# Altium schematic sheet CM5_Schem_V2.SchDoc (part 3 of 3)
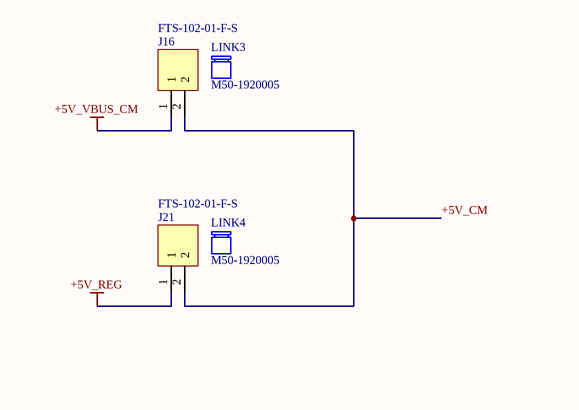
[diagram p5: CM5_Schem_V2.SchDoc, bottom right]

## Library data of the parts (continued)
U6 = TPS563209DDCR: IC REG BUCK ADJ 3A SOT23; Manufacturer: Texas Instruments; Package Body Material: Plastic; Throw Configuration: SWITCHING REGULATOR; Control Technique: PULSE WIDTH MODULATION; Max Supply Voltage: 17V; Min Input Voltage: 4.5V; Nominal Supply Voltage: 12V; Channels: 1; Max Output current: 5.3A; Frequency: 650kHz; Supplier: Digikey; Supplier Part Number: 296-40813-1-ND; Manufacturer Part Number: TPS563209DDCR; RoHS: Yes; Category: Voltage Regulators - Switching; Stock: 3662; Pricing: 1=0.9, 10=0.643, 25=0.5796, 100=0.5095, 250=0.47608, 500=0.45596, 1000=0.43938 (USD); Case/Package: TSSOP; Pins: 6; Package Shape: Rectangular; Terminal Finish: Tin; Min Operating Temperature: -40°C; Max Operating Temperature: 85°C; JESD-609 Code: e3; JESD-30 Code: R-PDSO-G6; Moisture Sensitivity Level: 1; Package Style: SMALL OUTLINE, THIN PROFILE, SHRINK PITCHMeter; Peak Reflow Temperature (Cel): 260°C; Surface Mount: Yes; Switcher Configuration: BUCK; Terminal Form: Gull Wing; Terminal Position: DUAL; Length: 2.9mm; Width: 1.6mm; Height - Seated (Max): 1.1mm; Terminal Pitch: 0.95mm; Temperature Grade: INDUSTRIAL; Reach SVHC Compliant: Yes; RoHS Compliant: Yes; ComponentLink1URL: https://www.ti.com:443/lit/ds/symlink/tps562209.pdf?src-supplier=IHS+Markit; ComponentLink1Description: https://www.ti.com:443/lit/ds/symlink/tps562209.pdf?src-supplier=IHS+Markit; ComponentLink2URL: http://www.ti.com/general/docs/lit/getliterature.tsp?genericPartNumber=TPS562209&&fileType=pdf&src-supplier=Avnet; ComponentLink2Description: http://www.ti.com/general/docs/lit/getliterature.tsp?genericPartNumber=TPS562209&&fileType=pdf&src-supplier=Avnet; ComponentLink3URL: http://www.ti.com/general/docs/suppproductinfo.tsp?distId=10&amp;gotoUrl=http%3A%2F%2Fwww.ti.com%2Flit%2Fgpn%2Ftps563209&src-supplier=Digikey; ComponentLink3Description: http://www.ti.com/general/docs/suppproductinfo.tsp?distId=10&amp;gotoUrl=http%3A%2F%2Fwww.ti.com%2Flit%2Fgpn%2Ftps563209&src-supplier=Digikey; ComponentLink4URL: http://www.ti.com/lit/ds/symlink/tps563209.pdf?src-supplier=Digikey; ComponentLink4Description: http://www.ti.com/lit/ds/symlink/tps563209.pdf?src-supplier=Digikey; ComponentLink5URL: http://www.ti.com/lit/gpn/tps563209?src-supplier=Mouser; ComponentLink5Description: http://www.ti.com/lit/gpn/tps563209?src-supplier=Mouser; LCSC Part Number: C181974
U22 = DF40C-100DS-0.4V(51)_MOD1A: CONN RCPT 100POS SMD GOLD; Manufacturer: Hirose; Connector Type: BOARD CONNECTOR; Option: General Purpose; Additional Feature: ROHS COMPLIANT; Body/Shell Style: RECEPTACLE; Contact Pattern: RECTANGULAR; Contact Resistance: 90mR; Dielectric Withstanding Voltage (AC): 100V; Durability: 30Cycles; Filter Feature: No; Insulation Resistance: 50MR; Number Of Connectors: 1; Number Of PCB Rows: 2; Polarization Key: POLARIZED HOUSING; Rated Current (Signal): 300mA; Number of Contacts: 100; Mating Contact Pitch: 0.016inch; Mounting Option 1: LOCKING; PCB Contact Row Spacing: 2.6416mm; Reference Standard: UL; Reliability: COMMERCIAL; Supplier: Digikey; Supplier Part Number: H11615CT-ND; Manufacturer Part Number: DF40C-100DS-0.4V(51); RoHS: Yes; Category: Card Edge Connectors; Stock: 81087; Pricing: 1=1.76, 10=1.493, 25=1.3992, 50=1.3322, 100=1.2686, 250=1.18908, 500=1.1323, 1000=1.07825, 2500=1.071, 5000=0.96257, 10000=0.91668 (USD); Mounting Technology: Board; Contact Material: Bronze; Contact Finish - Mating: GOLD; Contact Finish - Termination: GOLD; Insulation Color: Black; Insulation Material: Polymer; Min Operating Temperature: -35°C; Max Operating Temperature: 85°C; JESD-609 Code: e4; Contact Gender: Female; Mixed Contacts: No; Mounting Style: STRAIGHT; Number of Rows Loaded: 2; PCB Contact Pattern: RECTANGULAR; Termination: SMD/SMT; Terminal Pitch: 0.4mm; Flammability Rating: UL94 V-0; DIN Conformance: No; IEC Conformance: No; MIL Conformance: No; Reach SVHC Compliant: Yes; RoHS Compliant: Yes; ComponentLink1URL: https://datasheet.ciiva.com:443/pdfs/VipMasterIC/IC/HIRO/HIRO-S-A0007918127/HIRO-S-A0007946844-1.pdf?src-supplier=IHS+Markit; ComponentLink1Description: https://datasheet.ciiva.com:443/pdfs/VipMasterIC/IC/HIRO/HIRO-S-A0007918127/HIRO-S-A0007946844-1.pdf?src-supplier=IHS+Markit; ComponentLink2URL: https://datasheet.ciiva.com/26948/getdatasheetpartid-441624-26948933.pdf?src-supplier=Verical; ComponentLink2Description: https://datasheet.ciiva.com/26948/getdatasheetpartid-441624-26948933.pdf?src-supplier=Verical; ComponentLink3URL: https://datasheet.ciiva.com/46408/1824826-46408894.pdf?src-supplier=Element14; ComponentLink3Description: https://datasheet.ciiva.com/46408/1824826-46408894.pdf?src-supplier=Element14; Quantity: 1; LCSC Part Number: C597931
U23 = DF40C-100DS-0.4V(51)_MOD1B: CONN RCPT 100POS SMD GOLD; Manufacturer: Hirose; Connector Type: BOARD CONNECTOR; Option: General Purpose; Additional Feature: ROHS COMPLIANT; Body/Shell Style: RECEPTACLE; Contact Pattern: RECTANGULAR; Contact Resistance: 90mR; Dielectric Withstanding Voltage (AC): 100V; Durability: 30Cycles; Filter Feature: No; Insulation Resistance: 50MR; Number Of Connectors: 1; Number Of PCB Rows: 2; Polarization Key: POLARIZED HOUSING; Rated Current (Signal): 300mA; Number of Contacts: 100; Mating Contact Pitch: 0.016inch; Mounting Option 1: LOCKING; PCB Contact Row Spacing: 2.6416mm; Reference Standard: UL; Reliability: COMMERCIAL; Supplier: Digikey; Supplier Part Number: H11615CT-ND; Manufacturer Part Number: DF40C-100DS-0.4V(51); RoHS: Yes; Category: Card Edge Connectors; Stock: 81087; Pricing: 1=1.76, 10=1.493, 25=1.3992, 50=1.3322, 100=1.2686, 250=1.18908, 500=1.1323, 1000=1.07825, 2500=1.071, 5000=0.96257, 10000=0.91668 (USD); Mounting Technology: Board; Contact Material: Bronze; Contact Finish - Mating: GOLD; Contact Finish - Termination: GOLD; Insulation Color: Black; Insulation Material: Polymer; Min Operating Temperature: -35°C; Max Operating Temperature: 85°C; JESD-609 Code: e4; Contact Gender: Female; Mixed Contacts: No; Mounting Style: STRAIGHT; Number of Rows Loaded: 2; PCB Contact Pattern: RECTANGULAR; Termination: SMD/SMT; Terminal Pitch: 0.4mm; Flammability Rating: UL94 V-0; DIN Conformance: No; IEC Conformance: No; MIL Conformance: No; Reach SVHC Compliant: Yes; RoHS Compliant: Yes; ComponentLink1URL: https://datasheet.ciiva.com:443/pdfs/VipMasterIC/IC/HIRO/HIRO-S-A0007918127/HIRO-S-A0007946844-1.pdf?src-supplier=IHS+Markit; ComponentLink1Description: https://datasheet.ciiva.com:443/pdfs/VipMasterIC/IC/HIRO/HIRO-S-A0007918127/HIRO-S-A0007946844-1.pdf?src-supplier=IHS+Markit; ComponentLink2URL: https://datasheet.ciiva.com/26948/getdatasheetpartid-441624-26948933.pdf?src-supplier=Verical; ComponentLink2Description: https://datasheet.ciiva.com/26948/getdatasheetpartid-441624-26948933.pdf?src-supplier=Verical; ComponentLink3URL: https://datasheet.ciiva.com/46408/1824826-46408894.pdf?src-supplier=Element14; ComponentLink3Description: https://datasheet.ciiva.com/46408/1824826-46408894.pdf?src-supplier=Element14; Quantity: 1; LCSC Part Number: C597931